# Altium schematic sheet Relay_Analog.SchDoc
size A4; SheetNumber: 2; SheetTotal: 3; SPICEModelCacheDQOFJLTE: <root> / <DocumentId>DQOFJLTE</DocumentId> / </root>
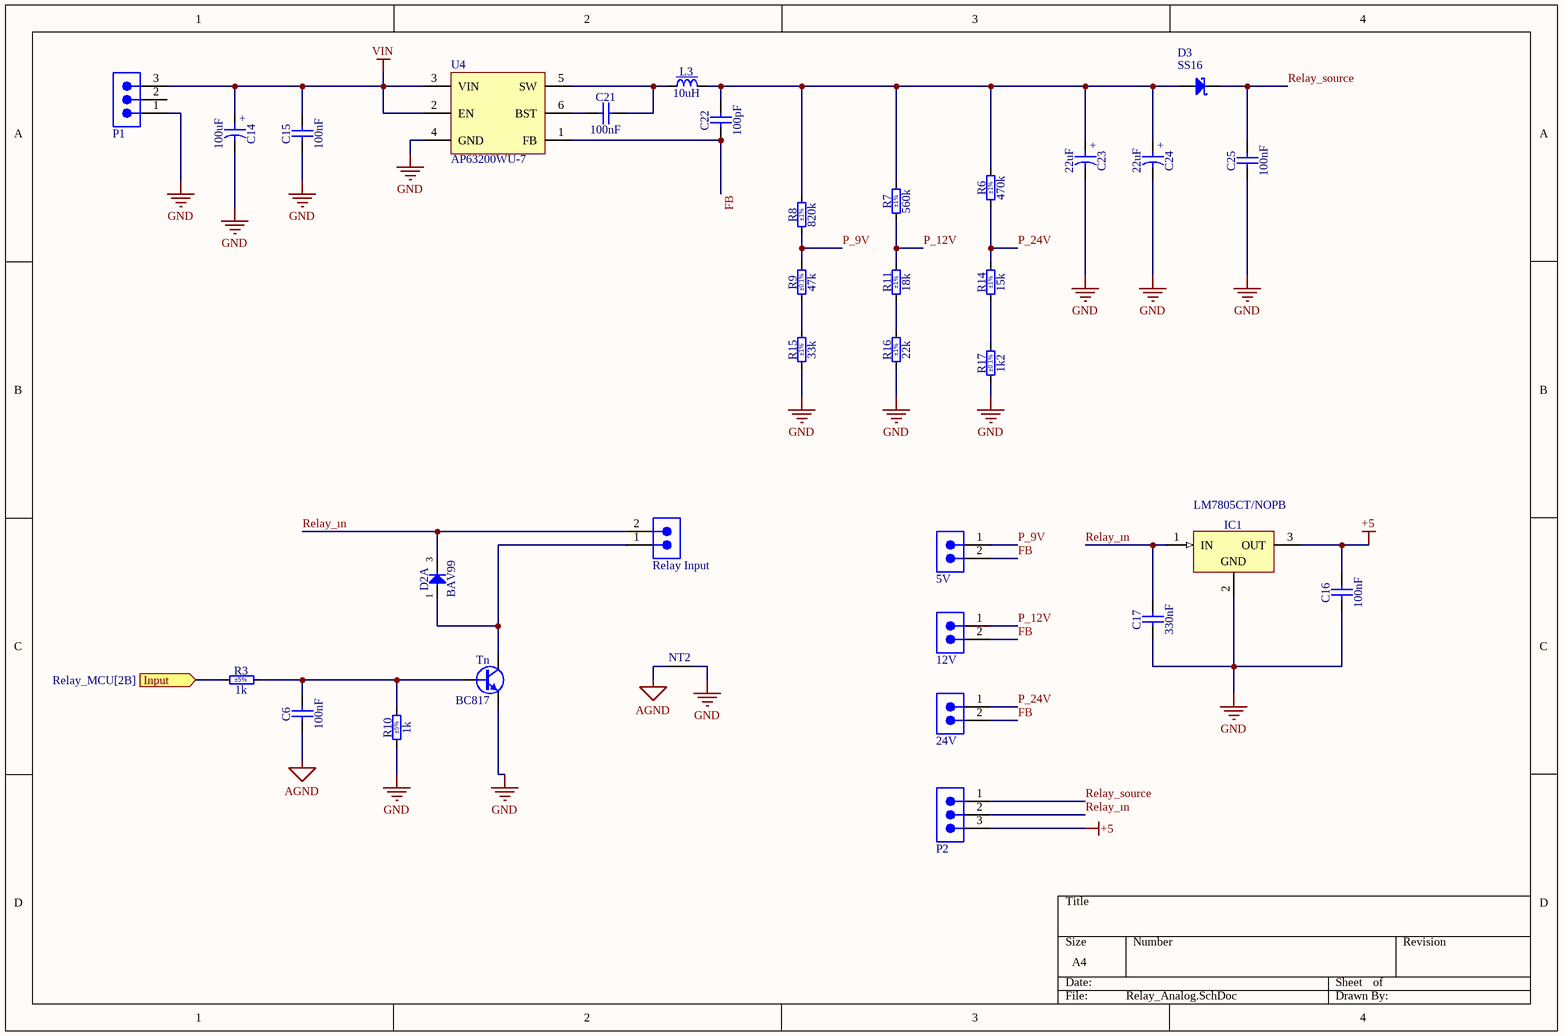
[diagram p0: Relay_Analog.SchDoc]

## Parts
5V  61300211121  [61300211121]  (value not drawn)
12V  61300211121  [61300211121]  (value not drawn)
24V  61300211121  [61300211121]  (value not drawn)
C6  100nF  [CAPC2012X135N]
C14  100uF  [CAPPR250-680X1250]
C15  100nF  [CAPC2012X135N]
C16  100nF  [CAPC2012X135N]
C17  330nF  [CAPC2012X135N]
C21  100nF  [CAPC2012X135N]
C22  100pF  [CAPC2012X135N]
C23  22uF  [CAPPR250-500X1100]
C24  22uF  [CAPPR250-500X1100]
C25  100nF  [CAPC2012X135N]
D2  BAV99  [SOT95P240X110-3N]  (part A of 2)
D3  SS16  [DIOM5127X229N]
IC1  LM7805CT/NOPB  [TO-220-V]
L3  10uH  [IND_TRACO_TCK-047]
NT2  (no value)  [NET-TIE]  (net tie, no BOM)
P1  691322310003  [691322310003]  (value not drawn)
P2  61300311121  [61300311121]  (value not drawn)
R3  1k  Tolerance: ±5%  [RESC2012X60N]
R6  470k  Tolerance: ±1%  [RESC2012X60N]
R7  560k  Tolerance: ±1%  [RESC2012X60N]
R8  820k  Tolerance: ±1%  [RESC2012X60N]
R9  47k  Tolerance: ±0.1%  [RESC2012X60N]
R10  1k  Tolerance: ±5%  [RESC2012X60N]
R11  18k  Tolerance: ±1%  [RESC2012X60N]
R14  15k  Tolerance: ±1%  [RESC2012X60N]
R15  33k  Tolerance: ±1%  [RESC2012X60N]
R16  22k  Tolerance: ±1%  [RESC2012X60N]
R17  1k2  Tolerance: ±0.1%  [RESC2013X65N]
Relay_Input  691322310002  [691322310002]  (value not drawn)
Tn  BC817  [SOT95P230X110-3N]
U4  AP63200WU-7  [TSOT26]

## Ports
Input (in, see Relay_MCU[2B])

## Nets
+5: C16.2 IC1.3(OUT) P2.3
AGND: C6.1 NT2.1
GND: C14.2 C15.1 C16.1 C17.1 C23.2 C24.2 C25.1 IC1.2(GND) NT2.2 P1.1 R10.1 R15.1 R16.1 R17.1 Tn.2(E) U4.4(GND)
VIN: C14.1 C15.2 P1.3 U4.2(EN) U4.3(VIN)
FB: 5V.2 12V.2 24V.2 C22.1 U4.1(FB)
Input: R3.1 ; port Input
P_9V: 5V.1 R8.1 R9.2
P_12V: 12V.1 R7.1 R11.2
P_24V: 24V.1 R6.1 R14.2
Relay_source: C25.2 D3.1(C) P2.1
Relay_ın: C17.2 D2.3(COMAC) IC1.1(IN) P2.2 Relay_Input.2
NetC6_2: C6.2 R3.2 R10.2 Tn.1(B)
NetC21_1: C21.1 U4.6(BST)
NetC21_2: C21.2 L3.1 U4.5(SW)
NetC22_2: C22.2 C23.1 C24.1 D3.2(A) L3.2 R6.2 R7.2 R8.2
NetD2_1: D2.1(A) Relay_Input.1 Tn.3(C)
NetR9_1: R9.1 R15.2
NetR11_1: R11.1 R16.2
NetR14_1: R14.1 R17.2

Not connected (* = marked no-connect by the designer): P1 2

## Notes on the sheet
- (in symbol CAER_47UF_25V_20%_250-500X1100) +
- (in symbol CAER_100UF_25V_20%_NICHICON_UPS1E101MED) +

## Library data of the parts
5V 12V 24V = 61300211121: WR-PHD Pin Header, THT, Vertical, pitch 2.54mm, 1 Row, 2P; Manufacturer: Wurth Elektronik; Contact Resistance: 20mOhm; Rated Current: 3A; Working Voltage: 250V; Withstanding Voltage: 500V; Manufacturer Part Number: 61300211121; Category: Board-to-Board Connectors; Match Code: WR-PHD; ComponentLink1Description: Website Link; ComponentLink1URL: https://www.we-online.com/redexpert/article/61300211121?ad; ComponentLink2Description: Datasheet Link; ComponentLink2URL: https://www.we-online.com/redexpert/spec/61300211121?ad; Mount: Through Hole; Operating Temperature Max: 105°C; Operating Temperature Min: -40°C; Packaging: Bag; Gender: Pin Header; Number of Pins: 2; Number of Rows: 1; Orientation: Vertical; Pitch: 2.54mm
C6 C15 C16 C21 C25 = CC0805_100NF_50V_10%_X7R: Non-polarised capacitor; Part Description: SMD Multilayer Chip Ceramic Capacitor; Manufacturer: GENERIC; Manufacturer1 Part Number: C2012X7R1H104K085; Voltage: 50V; TC: X7R; Tolerance: ±10%; Part Number: CC0805_100NF_50V_10%_X7R; Component Kind: Standard; Component Type: Standard; Pin Count: 2; Value: 100nF; Status: None; Manufacturer Part Number: CC0805_100NF_50V_10%_X7R; Case: 0805; Mounted: Yes; Socket: No; SMD: Yes; Sense: No; Manufacturer1 Example: TDK; Manufacturer1 ComponentHeight: 1mm; HelpURL: \\cern.ch\dfs\Applications\Altium\Datasheets\CC0805_X7R_TDK_C.pdf; Author: CERN DEM JLC; CreateDate: 3.12.2007; LatestRevisionDate: 22.04.2015
C14 = CAER_100UF_25V_20%_NICHICON_UPS1E101MED: Polarised capacitor; Part Description: Aluminium Electrolytic Capacitor (UPS Series); Voltage: 25V; Tolerance: ±20%; Part Number: CAER_100UF_25V_20%_NICHICON_UPS1E101MED; Component Kind: Standard; Component Type: Standard; Pin Count: 2; Value: 100uF; Status: None; Manufacturer: NICHICON; Manufacturer Part Number: UPS1E101MED; Case: LS2.5 D6.3 x H11; Mounted: Yes; Socket: No; SMD: No; Sense: No; ComponentHeight: 12.5mm; HelpURL: \\cern.ch\dfs\Applications\Altium\Datasheets\CAER_NICHICON_UPS.pdf; Author: CERN DEM MR; CreateDate: 30.05.2016; LatestRevisionDate: 30.05.2016
C17 = CC0805_330NF_16V_10%_X7R: Non-polarised capacitor; Part Description: SMD Multilayer Chip Ceramic Capacitor; Manufacturer: GENERIC; Manufacturer1 Part Number: CC0805KKX7R7BB334; Voltage: 16V; TC: X7R; Tolerance: ±10%; Part Number: CC0805_330NF_16V_10%_X7R; Component Kind: Standard; Component Type: Standard; Pin Count: 2; Value: 330nF; Status: Preferred; Manufacturer Part Number: CC0805_330NF_16V_10%_X7R; Case: 0805; Mounted: Yes; Socket: No; SMD: Yes; Sense: No; Manufacturer1 Example: YAGEO PHYCOMP; Manufacturer1 ComponentHeight: 1.45mm; HelpURL: \\cern.ch\dfs\Applications\Altium\Datasheets\CC0805_X7R_YAGEO_HIGH CAPACITANCE_MAX50V.pdf; Author: CERN DEM JLC; CreateDate: 3.12.2007; LatestRevisionDate: 21.04.2015
C22 = CC0805_100PF_50V_5%_NP0: Non-polarised capacitor; Part Description: SMD Multilayer Chip Ceramic Capacitor; Manufacturer: GENERIC; Manufacturer1 Part Number: 223886115101; Voltage: 50V; TC: C0G/NP0; Tolerance: ±5%; Part Number: CC0805_100PF_50V_5%_NP0; Component Kind: Standard; Component Type: Standard; Pin Count: 2; Value: 100pF; Status: Preferred; Manufacturer Part Number: CC0805_100PF_50V_5%_NP0; Case: 0805; Mounted: Yes; Socket: No; SMD: Yes; Sense: No; Manufacturer1 Example: PHYCOMP; Manufacturer1 ComponentHeight: 1.35mm; HelpURL: \\cern.ch\dfs\Applications\Altium\Datasheets\CC0805_NP0_PHYCOMP.pdf; Author: CERN DEM JLC; CreateDate: 3.12.2007; LatestRevisionDate: 3.12.2007
C23 C24 = CAER_47UF_25V_20%_250-500X1100: Polarised capacitor; Part Number: CAER_22UF_25V_20%_250-500X1100; Part Description: Aluminum Electrolytic Capacitor; Manufacturer: GENERIC; Manufacturer1 Part Number: EEUFC1E470; Voltage: 25V; Tolerance: ±20%; Component Kind: Standard; Component Type: Standard; Pin Count: 2; Value: 22uF; Status: Preferred; Manufacturer Part Number: CAER_47UF_25V_20%_250-500X1100; Case: LS2.5 D5 x H11; Mounted: Yes; Socket: No; SMD: No; Sense: No; ComponentHeight: 11mm; Manufacturer1 Example: PANASONIC; Manufacturer1 ComponentHeight: 11mm; HelpURL: \\cern.ch\dfs\Applications\Altium\Datasheets\CAER_PANASONIC_FC.pdf; Author: CERN DEM JLC; CreateDate: 18.12.2007; LatestRevisionDate: 18.12.2007
D2 = BAV99: Serial Diode; Part Description: Dual Series Signal Diode; Manufacturer: FAIRCHILD SEMICONDUCTOR; Voltage: 70V; Power: 350mW; PressFit: No; Bonding: No; Part Number: BAV99; Component Kind: Standard; Component Type: Standard; Device: BAV99; PackageDescription: SOT, 0.95mm Pitch; 3 Pin, 1.40mm W X 3.00mm L X 1.10mm H body, IPC Medium Density; Manufacturer Part Number: BAV99; Pin Count: 3; Case: SOT23-3; Mounted: Yes; Socket: No; SMD: Yes; Sense: No; ComponentHeight: 1.1mm; HelpURL: \\cern.ch\dfs\Applications\Altium\Datasheets\BAV99.pdf; Author: CERN DEM JLC; CreateDate: 6.05.2008; LatestRevisionDate: 27.09.2012
D3 = SS16: Schottky Diode; Part Description: Surface Mount Schottky Barrier Rectifier; Manufacturer: VISHAY GENERAL SEMICONDUCTOR; Voltage: 60V; Power: 1A; PressFit: No; Bonding: No; Part Number: SS16; Component Kind: Standard; Component Type: Standard; Device: SS16; PackageDescription: DO-214-AC/SMA Diode, Molded Body; 5.10mm L X 2.67mm W X 2.29mm H, IPC Medium Density; Manufacturer Part Number: SS16; Pin Count: 2; Case: DO-214AC; Mounted: Yes; Socket: No; SMD: Yes; Sense: No; ComponentHeight: 2.29mm; HelpURL: \\cern.ch\dfs\Applications\Altium\Datasheets\SS16.pdf; Author: CERN DEM JLC; CreateDate: 15.07.2008; LatestRevisionDate: 23.08.2010
IC1 = LM7805CT/NOPB_v: 3-Terminal Regulator 1=IN 2=GND 3=OUT; Part Description: 3-Terminal 5V 1A Positive Voltage Regulator; Manufacturer: TEXAS INSTRUMENTS; PressFit: No; Bonding: No; Part Number: LM7805CT/NOPB_v; Component Kind: Standard; Component Type: Standard; Device: LM7805CT/NOPB; PackageDescription: TO-220 3-Terminal + Tab - Vertical Mount; Manufacturer Part Number: LM7805CT; Pin Count: 3; Case: TO-220; Mounted: Yes; Socket: No; SMD: No; Sense: No; ComponentHeight: 18.95mm; HelpURL: \\cern.ch\dfs\Applications\Altium\Datasheets\LM7805CT-NOPB.pdf; Author: CERN DEM JLC; CreateDate: 18.12.2018; LatestRevisionDate: 1.06.2022
L3 = IND_10UH_20%_TRACO_TCK-047: Inductor With Core; Part Description: SMD Common Mode Choke; Manufacturer: TRACO POWER; Power: 1.44A; Resistance: 0.1R; Tolerance: ±20%; Part Number: IND_10UH_20%_TRACO_TCK-047; Component Kind: Standard; Component Type: Standard; Pin Count: 2; Value: 10uH; Manufacturer Part Number: TCK-047; Mounted: Yes; Socket: No; SMD: Yes; Sense: No; ComponentHeight: 4.85mm; HelpURL: \\cern.ch\dfs\Applications\Altium\Datasheets\IND_TRACO_TCK-047.pdf; Author: CERN DEM JLC; CreateDate: 16.11.2017; LatestRevisionDate: 16.11.2017
NT2 = Net Tie
P1 = 691322310003: WR-TBL Series 322 Horizontal PCB Header, THT, pitch 3.81mm, 3p; Manufacturer: Wurth Elektronik; Modularity: No; Rated Current: 10A; Working Voltage: 300V; Manufacturer Part Number: 691322310003; Category: Terminal Blocks; Match Code: WR-TBL; ComponentLink1Description: Website Link; ComponentLink1URL: https://www.we-online.com/redexpert/article/691322310003?ad; ComponentLink2Description: Datasheet Link; ComponentLink2URL: https://www.we-online.com/redexpert/spec/691322310003?ad; Mount: Through Hole; Operating Temperature Max: 105°C; Operating Temperature Min: -40°C; Packaging: Box; Application: Pluggable; Number of Pins: 3; Number of Rows: 1; Orientation: Horizontal; Pitch: 3.81mm
P2 = 61300311121: WR-PHD Pin Header, THT, Vertical, pitch 2.54mm, 1 Row, 3P; Manufacturer: Wurth Elektronik; Contact Resistance: 20mOhm; Rated Current: 3A; Working Voltage: 250V; Withstanding Voltage: 500V; Manufacturer Part Number: 61300311121; Category: Board-to-Board Connectors; Match Code: WR-PHD; ComponentLink1Description: Website Link; ComponentLink1URL: https://www.we-online.com/redexpert/article/61300311121?ad; ComponentLink2Description: Datasheet Link; ComponentLink2URL: https://www.we-online.com/redexpert/spec/61300311121?ad; Mount: Through Hole; Operating Temperature Max: 105°C; Operating Temperature Min: -40°C; Packaging: Bag; Gender: Pin Header; Number of Pins: 3; Number of Rows: 1; Orientation: Vertical; Pitch: 2.54mm
R3 R10 = R0805_1K_1%_0.125W_100PPM: Resistor - 5%; Part Number: R0805_1K_5%_0.125W_100PPM; Part Description: General Purpose Thick Film Chip Resistor; Manufacturer: GENERIC; Manufacturer1 Part Number: NRC10F1001TRF; Power: 0.125W; TC: ±100ppm/°C; PressFit: No; Component Kind: Standard; Component Type: Standard; Pin Count: 2; Value: 1k; Status: Preferred; Manufacturer Part Number: R0805_1K_5%_0.125W_100PPM; Case: 0805; Mounted: Yes; Sense: No; Socket: No; SMD: Yes; Manufacturer1 Example: NIC COMPONENT; Manufacturer1 ComponentHeight: 0.6mm; HelpURL: \\cern.ch\dfs\Applications\Altium\Datasheets\R0805_NIC_NRC.pdf; Author: CERN DEM JLC; CreateDate: 3.12.2007; LatestRevisionDate: 13.03.2008
R6 = R0805_470K_1%_0.125W_100PPM: Resistor - 1%; Part Description: General Purpose Thick Film Chip Resistor; Manufacturer: GENERIC; Manufacturer1 Part Number: NRC10F4703TRF; Power: 0.125W; TC: ±100ppm/°C; PressFit: No; Part Number: R0805_470K_1%_0.125W_100PPM; Component Kind: Standard; Component Type: Standard; Pin Count: 2; Value: 470k; Status: Preferred; Manufacturer Part Number: R0805_470K_1%_0.125W_100PPM; Case: 0805; Mounted: Yes; Sense: No; Socket: No; SMD: Yes; Manufacturer1 Example: NIC COMPONENT; Manufacturer1 ComponentHeight: 0.6mm; HelpURL: \\cern.ch\dfs\Applications\Altium\Datasheets\R0805_NIC_NRC.pdf; Author: CERN DEM JLC; CreateDate: 3.12.2007; LatestRevisionDate: 13.03.2008
R7 = R0805_560K_1%_0.125W_100PPM: Resistor - 1%; Part Description: General Purpose Thick Film Chip Resistor; Manufacturer: GENERIC; Manufacturer1 Part Number: NRC10F5603TRF; Power: 0.125W; TC: ±100ppm/°C; PressFit: No; Part Number: R0805_560K_1%_0.125W_100PPM; Component Kind: Standard; Component Type: Standard; Pin Count: 2; Value: 560k; Status: Preferred; Manufacturer Part Number: R0805_560K_1%_0.125W_100PPM; Case: 0805; Mounted: Yes; Sense: No; Socket: No; SMD: Yes; Manufacturer1 Example: NIC COMPONENT; Manufacturer1 ComponentHeight: 0.6mm; HelpURL: \\cern.ch\dfs\Applications\Altium\Datasheets\R0805_NIC_NRC.pdf; Author: CERN DEM JLC; CreateDate: 3.12.2007; LatestRevisionDate: 13.03.2008
R8 = R0805_820K_1%_0.125W_100PPM: Resistor - 1%; Part Description: General Purpose Thick Film Chip Resistor; Manufacturer: GENERIC; Manufacturer1 Part Number: NRC10F8203TRF; Power: 0.125W; TC: ±100ppm/°C; PressFit: No; Part Number: R0805_820K_1%_0.125W_100PPM; Component Kind: Standard; Component Type: Standard; Pin Count: 2; Value: 820k; Status: Preferred; Manufacturer Part Number: R0805_820K_1%_0.125W_100PPM; Case: 0805; Mounted: Yes; Sense: No; Socket: No; SMD: Yes; Manufacturer1 Example: NIC COMPONENT; Manufacturer1 ComponentHeight: 0.6mm; HelpURL: \\cern.ch\dfs\Applications\Altium\Datasheets\R0805_NIC_NRC.pdf; Author: CERN DEM JLC; CreateDate: 3.12.2007; LatestRevisionDate: 13.03.2008
R9 = R0805_47K_0.1%_0.125W_25PPM: Resistor - 0.1%; Part Description: Thin Film Chip Resistor; Manufacturer: GENERIC; Manufacturer1 Part Number: ERA6AEB473V; Power: 0.125W; TC: ±25ppm; PressFit: No; Part Number: R0805_47K_0.1%_0.125W_25PPM; Component Kind: Standard; Component Type: Standard; Pin Count: 2; Value: 47k; Status: Not Recommended; Manufacturer Part Number: R0805_47K_0.1%_0.125W_25PPM; Case: 0805; Mounted: Yes; Sense: No; Socket: No; SMD: Yes; Manufacturer1 Example: PANASONIC; Manufacturer1 ComponentHeight: 0.6mm; HelpURL: \\cern.ch\dfs\Applications\Altium\Datasheets\R0805_PANASONIC_ERA.pdf; Author: CERN DEM JLC; CreateDate: 18.10.2010; LatestRevisionDate: 18.10.2010
R11 = R0805_18K_1%_0.125W_100PPM: Resistor - 1%; Part Description: General Purpose Thick Film Chip Resistor; Manufacturer: GENERIC; Manufacturer1 Part Number: NRC10F1802TRF; Power: 0.125W; TC: ±100ppm/°C; PressFit: No; Part Number: R0805_18K_1%_0.125W_100PPM; Component Kind: Standard; Component Type: Standard; Pin Count: 2; Value: 18k; Status: Preferred; Manufacturer Part Number: R0805_18K_1%_0.125W_100PPM; Case: 0805; Mounted: Yes; Sense: No; Socket: No; SMD: Yes; Manufacturer1 Example: NIC COMPONENT; Manufacturer1 ComponentHeight: 0.6mm; HelpURL: \\cern.ch\dfs\Applications\Altium\Datasheets\R0805_NIC_NRC.pdf; Author: CERN DEM JLC; CreateDate: 3.12.2007; LatestRevisionDate: 13.03.2008
R14 = R0805_15K_1%_0.125W_100PPM: Resistor - 1%; Part Description: General Purpose Thick Film Chip Resistor; Manufacturer: GENERIC; Manufacturer1 Part Number: NRC10F1502TRF; Power: 0.125W; TC: ±100ppm/°C; PressFit: No; Part Number: R0805_15K_1%_0.125W_100PPM; Component Kind: Standard; Component Type: Standard; Pin Count: 2; Value: 15k; Status: Preferred; Manufacturer Part Number: R0805_15K_1%_0.125W_100PPM; Case: 0805; Mounted: Yes; Sense: No; Socket: No; SMD: Yes; Manufacturer1 Example: NIC COMPONENT; Manufacturer1 ComponentHeight: 0.6mm; HelpURL: \\cern.ch\dfs\Applications\Altium\Datasheets\R0805_NIC_NRC.pdf; Author: CERN DEM JLC; CreateDate: 13.05.2013; LatestRevisionDate: 13.05.2013
R15 = R0805_33K_1%_0.125W_100PPM: Resistor - 1%; Part Description: General Purpose Thick Film Chip Resistor; Manufacturer: GENERIC; Manufacturer1 Part Number: NRC10F3302TRF; Power: 0.125W; TC: ±100ppm/°C; PressFit: No; Part Number: R0805_33K_1%_0.125W_100PPM; Component Kind: Standard; Component Type: Standard; Pin Count: 2; Value: 33k; Status: Preferred; Manufacturer Part Number: R0805_33K_1%_0.125W_100PPM; Case: 0805; Mounted: Yes; Sense: No; Socket: No; SMD: Yes; Manufacturer1 Example: NIC COMPONENT; Manufacturer1 ComponentHeight: 0.6mm; HelpURL: \\cern.ch\dfs\Applications\Altium\Datasheets\R0805_NIC_NRC.pdf; Author: CERN DEM JLC; CreateDate: 3.12.2007; LatestRevisionDate: 13.03.2008
R16 = R0805_22K_1%_0.125W_100PPM: Resistor - 1%; Part Description: General Purpose Thick Film Chip Resistor; Manufacturer: GENERIC; Manufacturer1 Part Number: NRC10F2202TRF; Power: 0.125W; TC: ±100ppm/°C; PressFit: No; Part Number: R0805_22K_1%_0.125W_100PPM; Component Kind: Standard; Component Type: Standard; Pin Count: 2; Value: 22k; Status: Preferred; Manufacturer Part Number: R0805_22K_1%_0.125W_100PPM; Case: 0805; Mounted: Yes; Sense: No; Socket: No; SMD: Yes; Manufacturer1 Example: NIC COMPONENT; Manufacturer1 ComponentHeight: 0.6mm; HelpURL: \\cern.ch\dfs\Applications\Altium\Datasheets\R0805_NIC_NRC.pdf; Author: CERN DEM JLC; CreateDate: 3.12.2007; LatestRevisionDate: 13.03.2008
R17 = R0805_1K2_0.1%_0.1W_25PPM: Resistor - 0.1%; Part Description: Thin Film Precision Resistor; Manufacturer: GENERIC; Manufacturer1 Part Number: CPF0805B1K2E; Power: 0.1W; TC: ±25ppm/°C; PressFit: No; Part Number: R0805_1K2_0.1%_0.1W_25PPM; Component Kind: Standard; Component Type: Standard; Pin Count: 2; Value: 1k2; Status: Not Recommended; Manufacturer Part Number: R0805_1K2_0.1%_0.1W_25PPM; Case: 0805; Mounted: Yes; Sense: No; Socket: No; SMD: Yes; Manufacturer1 Example: TYCO ELECTRONICS; Manufacturer1 ComponentHeight: 0.65mm; HelpURL: \\cern.ch\dfs\Applications\Altium\Datasheets\R0805_TYCO_CPF.pdf; Author: CERN DEM JMW; CreateDate: 21.05.2010; LatestRevisionDate: 21.05.2010
Relay_Input = 691322310002: WR-TBL Series 322 Horizontal PCB Header, THT, pitch 3.81mm, 2p; Manufacturer: Wurth Elektronik; Modularity: No; Rated Current: 10A; Working Voltage: 300V; Manufacturer Part Number: 691322310002; Category: Terminal Blocks; Match Code: WR-TBL; ComponentLink1Description: Website Link; ComponentLink1URL: https://www.we-online.com/redexpert/article/691322310002?ad; ComponentLink2Description: Datasheet Link; ComponentLink2URL: https://www.we-online.com/redexpert/spec/691322310002?ad; Mount: Through Hole; Operating Temperature Max: 105°C; Operating Temperature Min: -40°C; Packaging: Box; Application: Pluggable; Number of Pins: 2; Number of Rows: 1; Orientation: Horizontal; Pitch: 3.81mm
Tn = BC817: NPN Transistor; Part Description: 45V 500mA NPN General-Purpose Transistor; Manufacturer: NXP SEMICONDUCTORS; PressFit: No; Bonding: No; Part Number: BC817; Component Kind: Standard; Component Type: Standard; Device: BC817; PackageDescription: SOT23, 0.95mm Pitch; 3 Pin, 1.30mm W X 2.90mm L X 1.10mm H body, IPC Medium Density; Manufacturer Part Number: BC817; Pin Count: 3; Case: SOT23-3; Mounted: Yes; Socket: No; SMD: Yes; Sense: No; ComponentHeight: 1.1mm; HelpURL: \\cern.ch\dfs\Applications\Altium\Datasheets\BC817.pdf; Author: CERN DEM JLC; CreateDate: 12.05.2011; LatestRevisionDate: 12.05.2011
U4 = AP63200WU-7: Switching Regulator; Manufacturer: Diodes; Supplier: Future Electronics; Supplier Part Number: 2108618; Manufacturer Part Number: AP63200WU-7; RoHS: Yes; Category: Voltage Regulators - Switching; Stock: 9000; Pricing: 3000=0,285, 6000=0,28, 9000=0,275, 12000=0,275, 15000=0,27 (USD); ComponentLink1URL: https://datasheet.ciiva.com:443/pdfs/VipMasterIC/IC/DIOD/DIOD-S-A0007089856/DIOD-S-A0007089856-1.pdf?src-supplier=IHS+Markit; ComponentLink1Description: https://datasheet.ciiva.com:443/pdfs/VipMasterIC/IC/DIOD/DIOD-S-A0007089856/DIOD-S-A0007089856-1.pdf?src-supplier=IHS+Markit; ComponentLink2URL: https://www.diodes.com/assets/Datasheets/AP63200-AP63201-AP63203-AP63205.pdf?src-supplier=Digikey; ComponentLink2Description: https://www.diodes.com/assets/Datasheets/AP63200-AP63201-AP63203-AP63205.pdf?src-supplier=Digikey